# EAGLE schematic board (EAGLE 7.7.0)
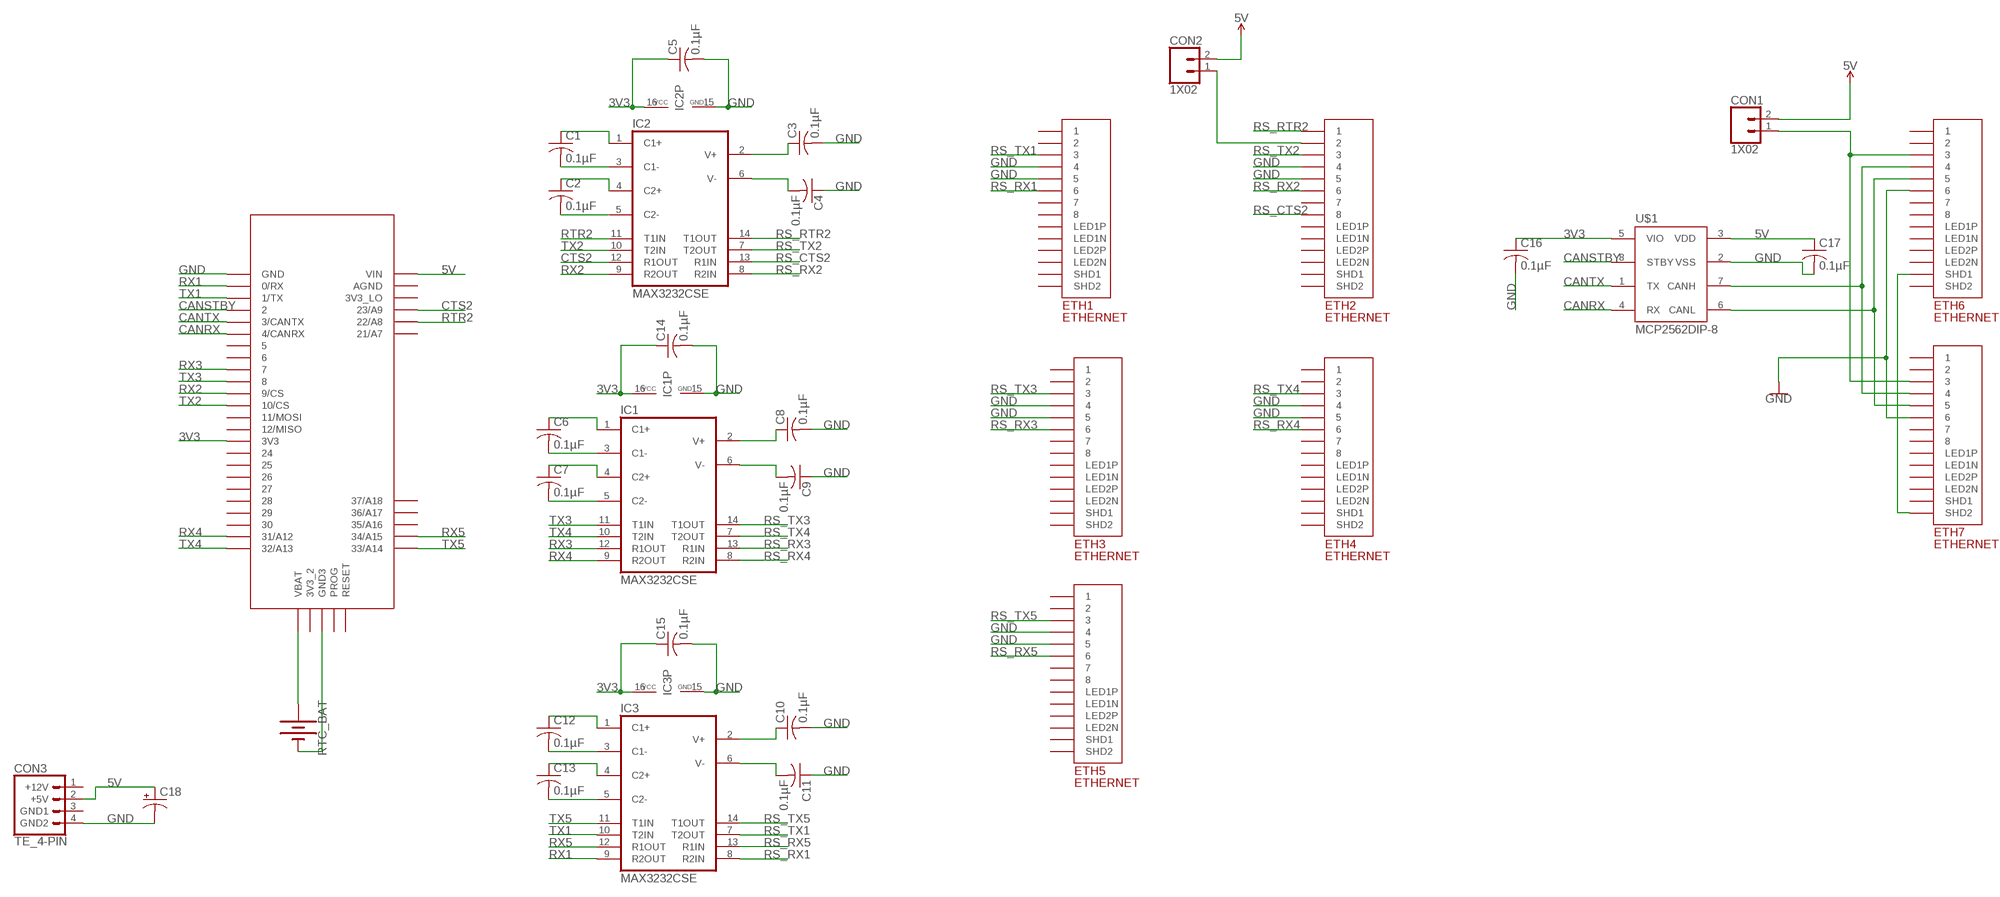
[diagram p0: schematic, sheet 1]

## Parts
C1  0.1µF  C-USC0805  [C0805]
C2  0.1µF  C-USC0805  [C0805]
C3  0.1µF  C-USC0805  [C0805]
C4  0.1µF  C-USC0805  [C0805]
C5  0.1µF  C-USC0805  [C0805]
C6  0.1µF  C-USC0805  [C0805]
C7  0.1µF  C-USC0805  [C0805]
C8  0.1µF  C-USC0805  [C0805]
C9  0.1µF  C-USC0805  [C0805]
C10  0.1µF  C-USC0805  [C0805]
C11  0.1µF  C-USC0805  [C0805]
C12  0.1µF  C-USC0805  [C0805]
C13  0.1µF  C-USC0805  [C0805]
C14  0.1µF  C-USC0805  [C0805]
C15  0.1µF  C-USC0805  [C0805]
C16  0.1µF  C-USC0805  [C0805]
C17  0.1µF  C-USC0805  [C0805]
C18  CAPACITOR_ELECTROLYTIC_100UF  [CAPACITOR_100UF_50V]
CON1  1X02  [1X02]
CON2  1X02  [1X02]
CON3  TE_4-PIN  [TE_4-PIN]
ETH1  ETHERNET  [A122645-ND]
ETH2  ETHERNET  [A122645-ND]
ETH3  ETHERNET  [A122645-ND]
ETH4  ETHERNET  [A122645-ND]
ETH5  ETHERNET  [A122645-ND]
ETH6  ETHERNET  [A122645-ND]
ETH7  ETHERNET  [A122645-ND]
IC1  MAX3232CSE  [SO16]
IC2  MAX3232CSE  [SO16]
IC3  MAX3232CSE  [SO16]
RTC_BAT  BATTERY-20MM_PTH  [BATTCOM_20MM_PTH]
U$1  MCP2562DIP-8  [DIL08]
U$3  TEENSY_3.5/3.6_NOPAD  [TEENSY_3.5/3.6_NOPAD]

## Nets
3V3: C5.1 C14.1 C15.1 C16.1 IC1.16(VCC) IC2.16(VCC) IC3.16(VCC) U$1.5(VIO) U$3.3V3
5V: C17.1 C18.+ CON1.2 CON2.2 CON3.2(+5V) U$1.3(VDD) U$3.VIN
CANRX: U$1.4(RX) U$3.4/CANRX
CANSTBY: U$1.8(STBY) U$3.2
CANTX: U$1.1(TX) U$3.3/CANTX
CTS2: IC2.12(R1OUT) U$3.23/A9
GND: C3.2 C4.1 C5.2 C8.2 C9.1 C10.2 C11.1 C14.2 C15.2 C16.2 C17.2 C18.- CON3.4(GND2) ETH1.P$4 ETH1.P$5 ETH2.P$4 ETH2.P$5 ETH3.P$4 ETH3.P$5 ETH4.P$4 ETH4.P$5 ETH5.P$4 ETH5.P$5 ETH6.P$6 ETH7.P$6 IC1.15(GND) IC2.15(GND) IC3.15(GND) U$1.2(VSS) U$3.GND
N$1: RTC_BAT.1(+) U$3.VBAT
N$2: RTC_BAT.2(-) U$3.GND3
N$3: ETH6.P$4 ETH7.P$4 U$1.7(CANH)
N$4: ETH6.P$5 ETH7.P$5 U$1.6(CANL)
N$5: ETH6.P$13(SHD1) ETH7.P$14(SHD2)
N$6: CON1.1 ETH6.P$3 ETH7.P$3
N$7: CON2.1 ETH2.P$2
N$15: C1.1 IC2.1(C1+)
N$16: C1.2 IC2.3(C1-)
N$17: C2.1 IC2.4(C2+)
N$18: C2.2 IC2.5(C2-)
N$19: C3.1 IC2.2(V+)
N$20: C4.2 IC2.6(V-)
N$21: C6.2 IC1.3(C1-)
N$22: C7.2 IC1.5(C2-)
N$23: C6.1 IC1.1(C1+)
N$24: C7.1 IC1.4(C2+)
N$25: C8.1 IC1.2(V+)
N$26: C9.2 IC1.6(V-)
N$27: C10.1 IC3.2(V+)
N$28: C11.2 IC3.6(V-)
N$29: C12.2 IC3.3(C1-)
N$30: C13.2 IC3.5(C2-)
N$31: C12.1 IC3.1(C1+)
N$32: C13.1 IC3.4(C2+)
RS_CTS2: ETH2.P$8 IC2.13(R1IN)
RS_RTR2: ETH2.P$1 IC2.14(T1OUT)
RS_RX1: ETH1.P$6 IC3.8(R2IN)
RS_RX2: ETH2.P$6 IC2.8(R2IN)
RS_RX3: ETH3.P$6 IC1.13(R1IN)
RS_RX4: ETH4.P$6 IC1.8(R2IN)
RS_RX5: ETH5.P$6 IC3.13(R1IN)
RS_TX1: ETH1.P$3 IC3.7(T2OUT)
RS_TX2: ETH2.P$3 IC2.7(T2OUT)
RS_TX3: ETH3.P$3 IC1.14(T1OUT)
RS_TX4: ETH4.P$3 IC1.7(T2OUT)
RS_TX5: ETH5.P$3 IC3.14(T1OUT)
RTR2: IC2.11(T1IN) U$3.22/A8
RX1: IC3.9(R2OUT) U$3.0/RX
RX2: IC2.9(R2OUT) U$3.9/CS
RX3: IC1.12(R1OUT) U$3.7
RX4: IC1.9(R2OUT) U$3.31/A12
RX5: IC3.12(R1OUT) U$3.34/A15
TX1: IC3.10(T2IN) U$3.1/TX
TX2: IC2.10(T2IN) U$3.10/CS
TX3: IC1.11(T1IN) U$3.8
TX4: IC1.10(T2IN) U$3.32/A13
TX5: IC3.11(T1IN) U$3.33/A14
Unconnected: CON3.1(+12V) CON3.3(GND1) ETH1.P$1 ETH1.P$2 ETH1.P$7 ETH1.P$8 ETH1.P$9(LED1N) ETH1.P$10(LED1P) ETH1.P$11(LED2N) ETH1.P$12(LED2P) ETH1.P$13(SHD1) ETH1.P$14(SHD2) ETH2.P$7 ETH2.P$9(LED1N) ETH2.P$10(LED1P) ETH2.P$11(LED2N) ETH2.P$12(LED2P) ETH2.P$13(SHD1) ETH2.P$14(SHD2) ETH3.P$1 ETH3.P$2 ETH3.P$7 ETH3.P$8 ETH3.P$9(LED1N) ETH3.P$10(LED1P) ETH3.P$11(LED2N) ETH3.P$12(LED2P) ETH3.P$13(SHD1) ETH3.P$14(SHD2) ETH4.P$1 ETH4.P$2 ETH4.P$7 ETH4.P$8 ETH4.P$9(LED1N) ETH4.P$10(LED1P) ETH4.P$11(LED2N) ETH4.P$12(LED2P) ETH4.P$13(SHD1) ETH4.P$14(SHD2) ETH5.P$1 ETH5.P$2 ETH5.P$7 ETH5.P$8 ETH5.P$9(LED1N) ETH5.P$10(LED1P) ETH5.P$11(LED2N) ETH5.P$12(LED2P) ETH5.P$13(SHD1) ETH5.P$14(SHD2) ETH6.P$1 ETH6.P$2 ETH6.P$7 ETH6.P$8 ETH6.P$9(LED1N) ETH6.P$10(LED1P) ETH6.P$11(LED2N) ETH6.P$12(LED2P) ETH6.P$14(SHD2) ETH7.P$1 ETH7.P$2 ETH7.P$7 ETH7.P$8 ETH7.P$9(LED1N) ETH7.P$10(LED1P) ETH7.P$11(LED2N) ETH7.P$12(LED2P) ETH7.P$13(SHD1) U$3.3V3_2 U$3.3V3_LO U$3.5 U$3.6 U$3.11/MOSI U$3.12/MISO U$3.21/A7 U$3.24 U$3.25 U$3.26 U$3.27 U$3.28 U$3.29 U$3.30 U$3.35/A16 U$3.36/A17 U$3.37/A18 U$3.AGND U$3.PROG U$3.RESET

## Library data of the parts
C1-C17 = rcl:C-US: CAPACITOR, American symbol
C18 = EcoCar-Passives:CAPACITOR_ELECTROLYTIC_100UF: 50V 100uF Electrolytic Capacitor Manufacturer: Nichicon Series: UVZ Part Number: UVZ1H101MPD1TD Digikey Part Number: 493-13464-1-ND
CON1 CON2 = EcoCar-Connectors-2.54mm:1X02: 2.54mm (0.1") Header
CON3 = EcoCar-Connectors:TE_4-PIN: 4 Pin TE Mini-Universal MATE-N-LOK - Use for 12V and 5V connections Part Number: 1-770968-0 Digikey Part Number: A32474-ND-40 Matching Plug: A25571-ND Matching Crimps: A100828CT-ND
ETH1-ETH7 = ETHERNET:ETHERNET: Ethernet port with 2 leds. digikey number A122645-ND
IC1-IC3 = maxim:MAX3232*: True RS-232 Transceivers 3.0V to 5.5V, Low-Power up to 1Mbps, Using Four 0.1µF External Capacitors Source: http://pdfserv.maxim-ic.com/en/ds/MAX3222-MAX3241.pdf; MPN: MAX3232CSE; OC_FARNELL: 9725490; OC_NEWARK: 90C2890
RTC_BAT = SparkFun-Batteries:BATTERY: Battery - Single Cell A variety of battery chemistries, sizes, and footprints. Device List: 20MM_PTH - Coin Cell Battery Holder - 20mm (PTH) <https://www.sparkfun.com/products/783> 20MM_PTH_KIT- Coin Cell battery Holder - 20 mm (PTH) <http://www.sparkfun.com/products/783>kit version with special mask 6.8MM_PTH - Coin Cell Battery Holder - 6.8MM(SMD) <https://www.digikey.com/product-detail/en/seiko-instruments/MS621FE-FL11E/728-1057-ND/1889208?WT.srch=1&gclid=CNOQ5a6LzdQCFZS2wAodXCkE0g> 12MM_SMD - Coin Cell Battery Holder - 12mm (SMD) <https://www.sparkfun.com/products/10592> 12MM_PTH - Coin Cell Battery Holder - 12mm (PTH) <https://www.sparkfun.com/products/7948> 20MM_SMD - 20mm Coin Cell Battery Holder (SMD) (2 legs) Used on the Big Time Watch Kit <https://www.sparkfun.com/products/11734> 20MM_SMD_4LEGS - Coin Cell Battery Holder - 20mm (SMD) <https://www.sparkfun.com/products/11892> 20MM_SMD_4LEGS_OVERPASTE - Coin Cell Battery Holder - 20mm (SMD) <https://www.sparkfun.com/products/11892> (Over-paste on the legs) 24.5MM_PTH - Coin Cell Battery Holder - 24.5mm (PTH) <https://www.sparkfun.com/products/8863> 9V - 9V Battery Holder - PC Mount Used on the SparkFun SparkPunk Sound Kit <https://www.sparkfun.com/products/11177> and SparkFun SparkPunk Sequencer Kit <https://www.sparkfun.com/products/12707> 18650 - Battery Holder - 18650 (PTH) <https://www.sparkfun.com/products/13113> AA - Battery Holder - 1xAA (PTH) <https://www.sparkfun.com/products/7949> AAA - Battery Holder - 1xAAA (PTH) <https://www.sparkfun.com/products/12718> AA_KIT - Battery Holder - 1xAA (PTH) <https://www.sparkfun.com/products/7949> Special kit package - pads only have exposed copper on one side of the board. AAA_KIT - Battery Holder - 1xAAA (PTH) <https://www.sparkfun.com/products/12718> Special kit package - pads only have exposed copper on one side of the board.; PROD_ID: BATT-09031; SF_SKU: PRT-00783
U$1 = diy:MCP2562
U$3 = Teensy356:TEENSY_3.5/3.6_NOPAD